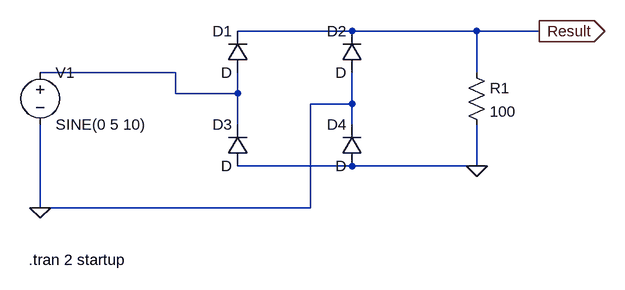
[diagram p0: schematic Full Wave Rectifier.asc]
Full Wave Rectifier.asc, the LTspice schematic file:
Version 4
SHEET 1 880 680
WIRE 304 64 128 64
WIRE 496 64 304 64
WIRE 592 64 496 64
WIRE 32 128 -176 128
WIRE 496 128 496 64
WIRE 32 160 32 128
WIRE 128 160 128 128
WIRE 128 160 32 160
WIRE 304 176 304 128
WIRE 304 176 240 176
WIRE 128 208 128 160
WIRE 304 208 304 176
WIRE 304 272 128 272
WIRE 496 272 496 208
WIRE 496 272 304 272
WIRE -176 336 -176 208
WIRE 240 336 240 176
WIRE 240 336 -176 336
FLAG 592 64 Result
IOPIN 592 64 Out
FLAG -176 336 0
FLAG 496 272 0
SYMBOL diode 144 128 R180
WINDOW 0 24 64 Left 2
WINDOW 3 24 0 Left 2
SYMATTR InstName D1
SYMBOL diode 320 128 R180
WINDOW 0 24 64 Left 2
WINDOW 3 24 0 Left 2
SYMATTR InstName D2
SYMBOL diode 144 272 R180
WINDOW 0 24 64 Left 2
WINDOW 3 24 0 Left 2
SYMATTR InstName D3
SYMBOL diode 320 272 R180
WINDOW 0 24 64 Left 2
WINDOW 3 24 0 Left 2
SYMATTR InstName D4
SYMBOL voltage -176 112 R0
WINDOW 123 0 0 Left 0
WINDOW 39 0 0 Left 0
SYMATTR InstName V1
SYMATTR Value SINE(0 5 10)
SYMBOL res 480 112 R0
SYMATTR InstName R1
SYMATTR Value 100
TEXT -194 416 Left 2 !.tran 2 startup

The netlist it stands for:
* Full Wave Rectifier.asc
D1 N001 Result D
D2 0 Result D
D3 0 N001 D
D4 0 0 D
V1 N001 0 SINE(0 5 10)
R1 Result 0 100
.model D D
.lib standard.dio
.tran 2 startup
.backanno
.end